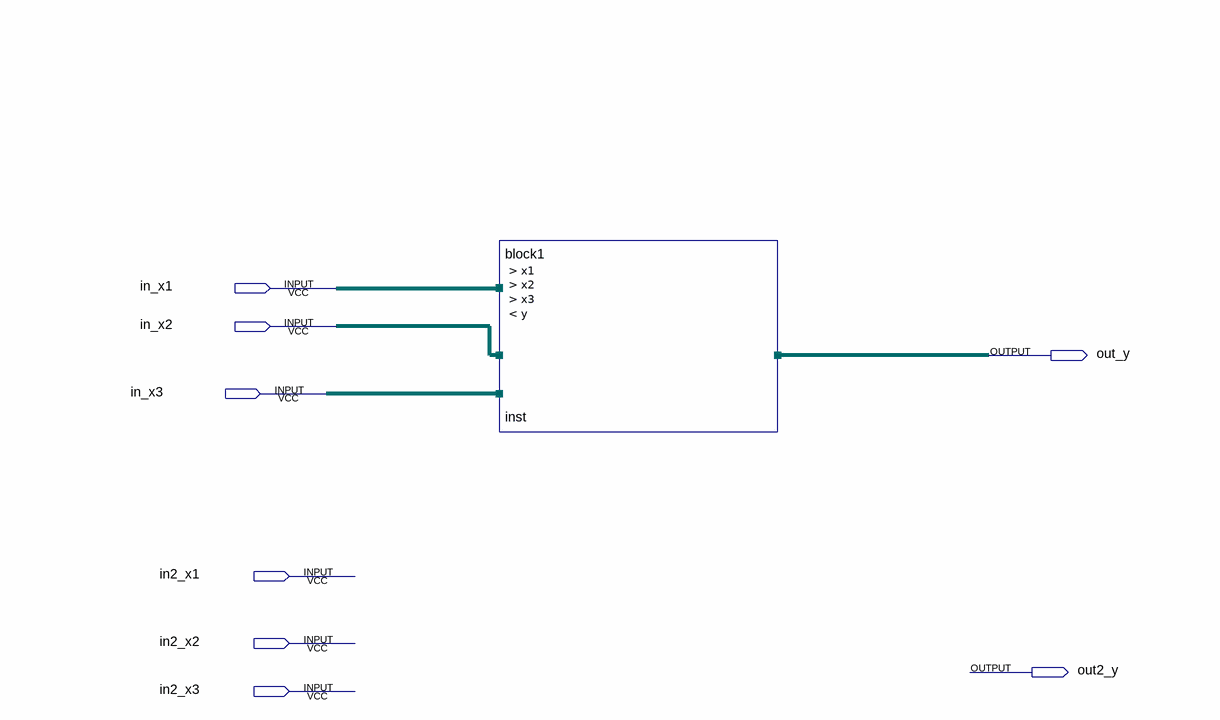
[diagram p0: schematic sheet]
// Quartus schematic cd-lab1.bdf as structural Verilog: 1 symbols, 8 pins
module \cd-lab1  (
  input  in_x1,
  input  in_x2,
  input  in_x3,
  input  in2_x1,
  input  in2_x2,
  input  in2_x3,
  output out_y,
  output out2_y
);

  block1 inst (.x1(in_x1), .x2(in_x2), .x3(in_x3), .y(out_y));
endmodule
